# EAGLE design FANCTRL (EAGLE 9.1.3)
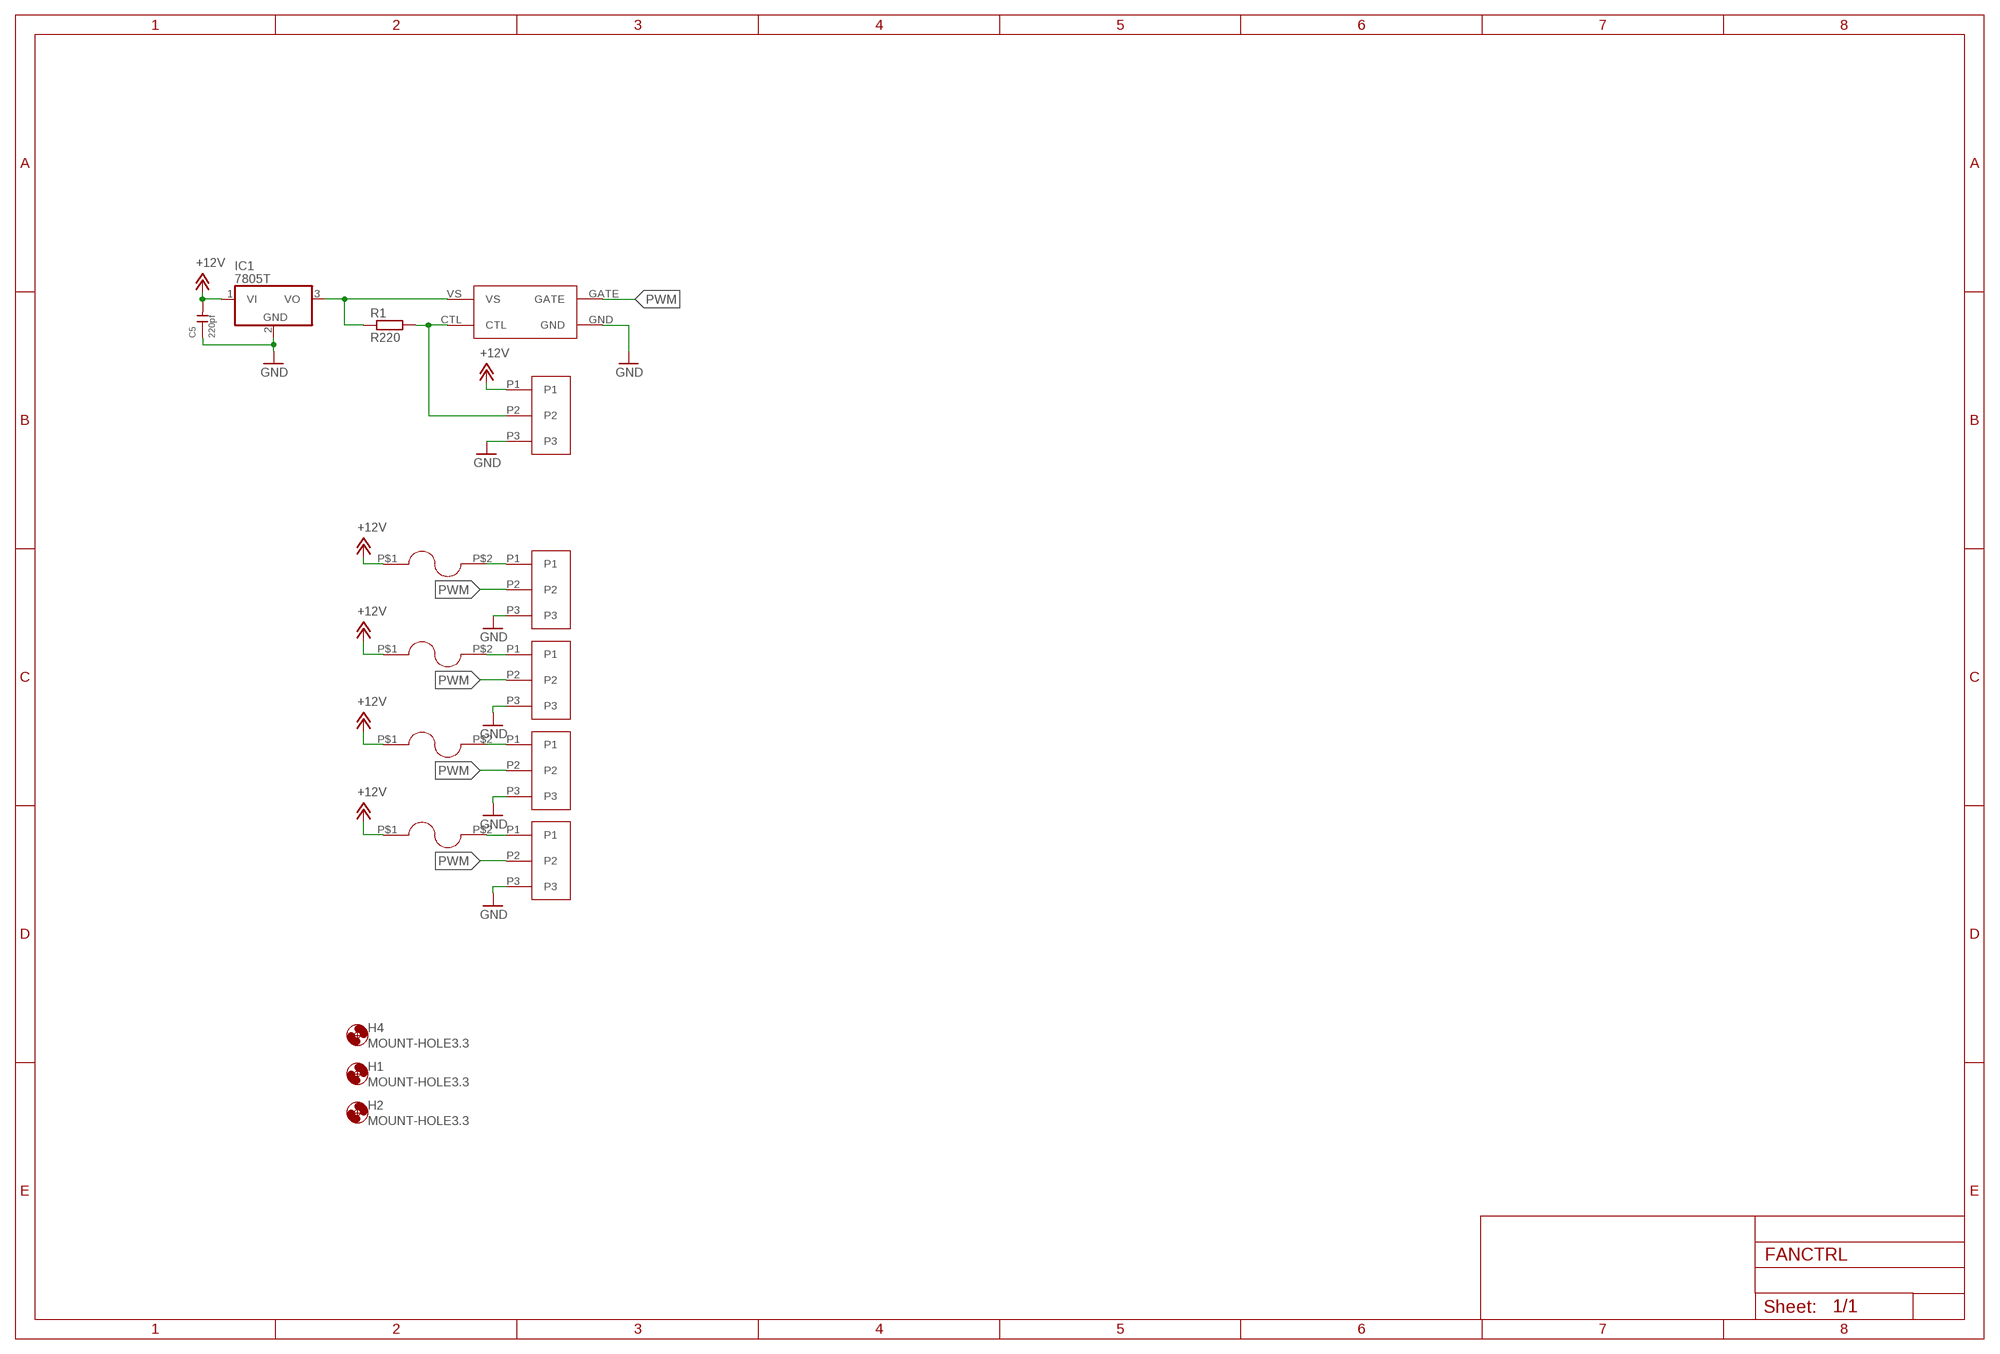
[diagram p0: schematic, sheet 1]

## Parts
C5  220pf  CERAMIC-220PF-50V-5%-NPO(0402)  [C0402]
H1  MOUNT-HOLE3.3  [3,3]
H2  MOUNT-HOLE3.3  [3,3]
H4  MOUNT-HOLE3.3  [3,3]
IC1  7805T  [TO220H]
R1  R220  R-EU_R0805  [R0805]
U$1  1935789  [1935789]
U$2  1935789  [1935789]
U$3  1935789  [1935789]
U$4  1935789  [1935789]
U$5  2920L400/15MR  [2920L400/15MR]
U$6  2920L400/15MR  [2920L400/15MR]
U$7  2920L400/15MR  [2920L400/15MR]
U$8  2920L400/15MR  [2920L400/15MR]
U$9  1935789  [1935789]
U$15  MIC4417  [PDM_2019_REVB_MIC4416YM4-TR]

## Nets
+12V: C5.2 IC1.1(VI) U$1.P1 U$5.P$1 U$6.P$1 U$7.P$1 U$8.P$1
GND: C5.1 IC1.2(GND) U$1.P3 U$2.P3 U$3.P3 U$4.P3 U$9.P3 U$15.GND
N$1: U$2.P1 U$5.P$2
N$2: U$3.P1 U$6.P$2
N$3: U$4.P1 U$7.P$2
N$4: U$8.P$2 U$9.P1
N$5: IC1.3(VO) R1.1 U$15.VS
N$6: R1.2 U$1.P2 U$15.CTL
PWM: U$2.P2 U$3.P2 U$4.P2 U$9.P2 U$15.GATE

## Library data of the parts
C5 = Seeed-Capacitor:CERAMIC-220PF-50V-5%-NPO(0402): 302010013; MPN: CC0402JRNPO9BN221
H1 H2 H4 = holes:MOUNT-HOLE: MOUNTING HOLE with drill center marker
IC1 = linear:78*: Positive VOLTAGE REGULATOR Source: http://cache.national.com/ds/LM/LM78L05.pdf http://www.fairchildsemi.com/ds/LM/LM7805.pdf
R1 = resistor:R-EU_: RESISTOR, European symbol
U$1-U$4 U$9 = 111FANCTRL:1935789
U$5-U$8 = 111FANCTRL:2920L400/15MR
U$15 = HVIB_v2:MIC4417; MPN: MIC4417

## Net classes
0 LV: width 0.2 mm, drill 0.15 mm, clearance 0.152 mm
1 HV: width 0.5 mm, drill 0.15 mm, clearance 2 mm

## Board
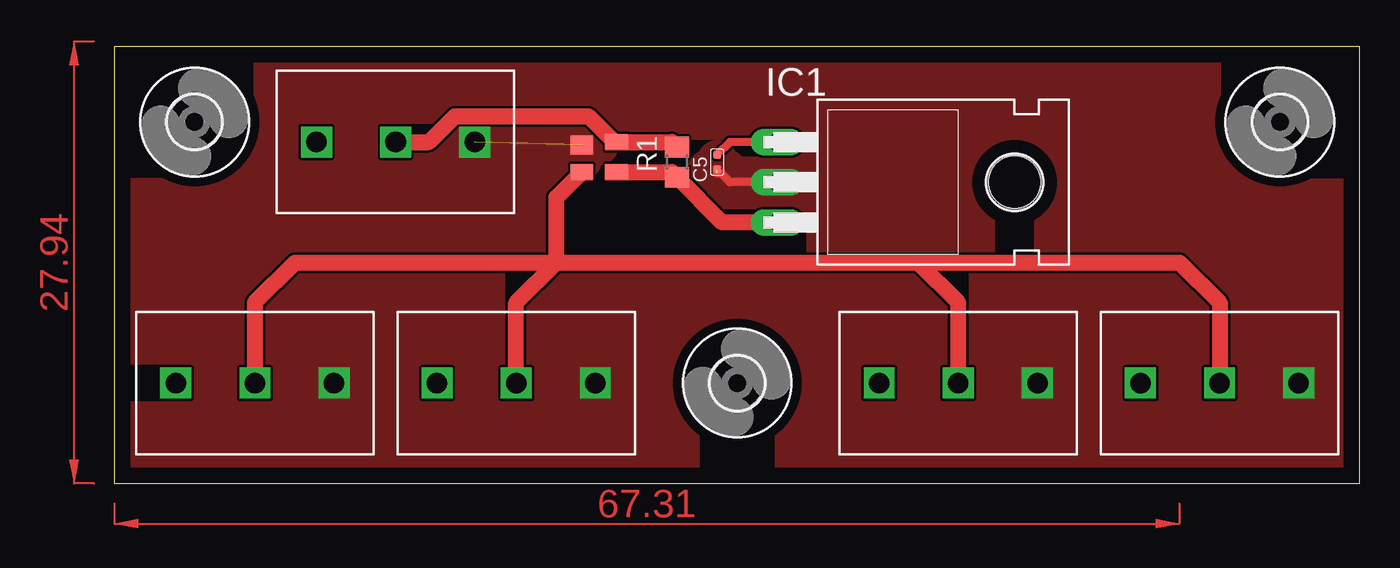
[diagram p1: board, top side]
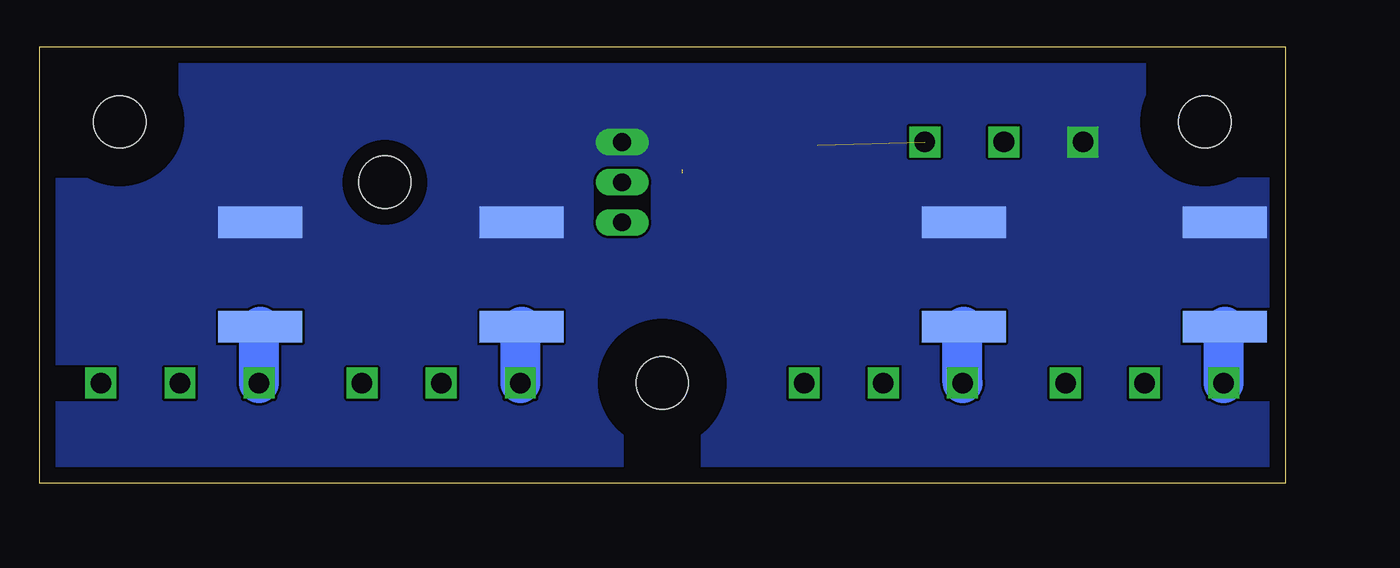
[diagram p2: board, bottom side, seen from below]

Size 78.72 x 27.61 mm. Coordinates in mm from the lower left corner, seen from the top.
Outline: 0,0 78.72,0 78.72,27.61 0,27.61 0,0
Copper layers (1*16): Top 0.035mm / dielectric 1.5mm / Bottom 0.035mm
Design rules "default": minimum track width 6mil, minimum drill 0.35mm, track to track 6mil, track to pad 6mil, pad to pad 6mil, via to via 6mil, smd to smd 6mil, copper to edge 40mil, drill to drill 6mil, minimum pad ring 10mil, minimum via ring 8mil, stop-mask expansion 4mil, vias tented up to drill 0mil, thermal gap 10mil

### Footprints (pad centres in the part's own frame; a part is rotated, then mirrored left to right if it is on the bottom)
C0402 = smd 0.5 x 0.5: 1 0,0.463; 2 0,-0.463
3,3 = hole 3.3: 0,0
TO220H = drill 1.118 long: 1 -2.54,-10.16; 2 0,-10.16; 3 2.54,-10.16 | hole 3.302: 0,4.826
R0805 = smd 1.3 x 1.5: 1 -0.95,0; 2 0.95,0
1935789 = drill 1.3 square: P1 -5,0; P2 0,0; P3 5,0
2920L400/15MR = smd 2 x 5.3: P$1 0,0; P$2 6.6,0
PDM_2019_REVB_MIC4416YM4-TR = smd 1 x 1.44: CTL 0,0; GATE 1.9,-2.2; VS 1.9,0 | smd 1.2 x 1.44: GND 0.2,-2.2

### Placement (x,y rotation side)
C5  38.1,20.32 180 top
H1  5.08,22.86 0 top
H2  73.66,22.86 0 top
H4  39.37,6.35 0 top
IC1  52.07,19.05 270 top
R1  35.56,20.32 90 top
U$1  17.78,21.59 0 top
U$2  25.4,6.35 0 top
U$3  53.34,6.35 0 top
U$4  8.89,6.35 0 top
U$5  20.32,16.51 270 bottom
U$6  48.26,16.51 270 bottom
U$7  3.81,16.51 270 bottom
U$8  64.77,16.51 270 bottom
U$9  69.85,6.35 0 top
U$15  31.75,21.59 270 top

### Tracks (layer width: path | path; a pad name or v marks a point on that pad's centre or on a via)
+12V
  Top 0.508: IC1.1 38.91,21.59 C5.2
  pour Bottom: 0,27.94 0,0 78.74,0 78.74,27.94
GND  (2 unrouted)
  Top 0.508: IC1.2 38.91,19.05 38.34,19.61 38.1,19.61
  pour Top: 0,27.94 0,0 78.74,0 78.74,27.94
N$1
  Bottom 2.54: U$2.P1 20.4,9.83 U$5.P$2
N$2
  Bottom 2.54: U$3.P1 48.34,9.83 U$6.P$2
N$3
  Bottom 2.54: U$4.P1 3.89,9.83 U$7.P$2
N$4
  Bottom 2.54: U$9.P1 64.85,9.83 U$8.P$2
N$5
  Top 1.016: U$15.VS 35.24,19.69 R1.1 38.42,16.51 IC1.3
N$6
  Top 1.016: R1.2 35.24,21.59 U$15.CTL 31.6,21.59 29.97,23.23 21.53,23.23 19.9,21.59 U$1.P2
PWM
  Top 1.016: U$4.P2 8.89,11.43 11.43,13.97 27.94,13.97 | U$9.P2 69.85,11.43 67.31,13.97 50.8,13.97 | 27.94,13.97 50.8,13.97 | U$3.P2 53.34,11.43 50.8,13.97 | U$2.P2 25.4,11.43 27.94,13.97 | 27.94,13.97 27.94,18.08 U$15.GATE
(copper drawn outside any net)
  shapes: Top area x2